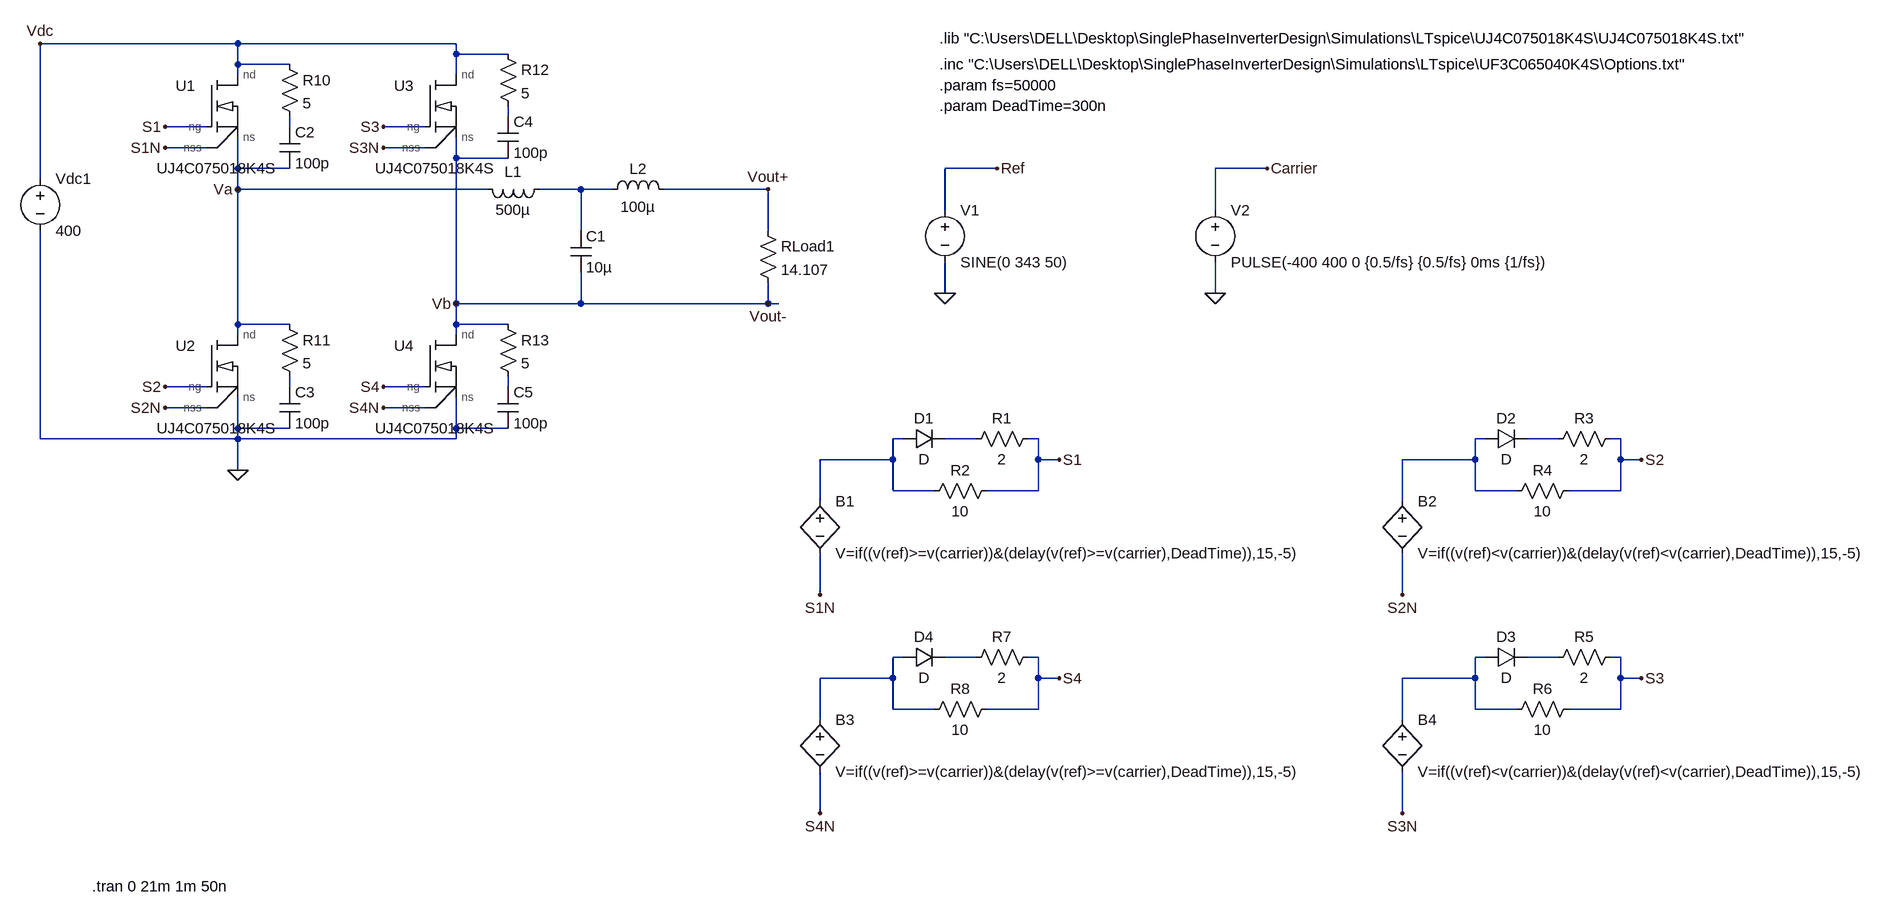
[diagram p0: schematic Bipolar_UJ4C075018K4S_DeadTime.asc]
Bipolar_UJ4C075018K4S_DeadTime.asc, the LTspice schematic file:
Version 4
SHEET 1 1412 752
WIRE -1328 -560 -1632 -560
WIRE -992 -560 -1328 -560
WIRE -992 -544 -992 -560
WIRE -912 -544 -992 -544
WIRE -1328 -528 -1328 -560
WIRE -1248 -528 -1328 -528
WIRE -1328 -512 -1328 -528
WIRE -992 -512 -992 -544
WIRE -912 -448 -912 -464
WIRE -1376 -432 -1440 -432
WIRE -1248 -432 -1248 -448
WIRE -1040 -432 -1104 -432
WIRE -1376 -400 -1440 -400
WIRE -1040 -400 -1104 -400
WIRE -992 -384 -992 -416
WIRE -912 -384 -992 -384
WIRE -1328 -368 -1328 -416
WIRE -1248 -368 -1328 -368
WIRE -160 -368 -240 -368
WIRE 256 -368 176 -368
WIRE -1632 -352 -1632 -560
WIRE -1328 -336 -1328 -368
WIRE -944 -336 -1328 -336
WIRE -800 -336 -864 -336
WIRE -752 -336 -800 -336
WIRE -512 -336 -672 -336
WIRE -240 -304 -240 -368
WIRE 176 -304 176 -368
WIRE -800 -272 -800 -336
WIRE -512 -272 -512 -336
WIRE -240 -176 -240 -224
WIRE 176 -176 176 -224
WIRE -992 -160 -992 -384
WIRE -800 -160 -800 -208
WIRE -800 -160 -992 -160
WIRE -512 -160 -512 -192
WIRE -512 -160 -800 -160
WIRE -496 -160 -512 -160
WIRE -1328 -128 -1328 -336
WIRE -1248 -128 -1328 -128
WIRE -992 -128 -992 -160
WIRE -912 -128 -992 -128
WIRE -1328 -112 -1328 -128
WIRE -992 -112 -992 -128
WIRE -1376 -32 -1440 -32
WIRE -1248 -32 -1248 -48
WIRE -1040 -32 -1104 -32
WIRE -912 -32 -912 -48
WIRE -1376 0 -1440 0
WIRE -1040 0 -1104 0
WIRE -1328 32 -1328 -16
WIRE -1248 32 -1328 32
WIRE -992 32 -992 -16
WIRE -912 32 -992 32
WIRE -1632 48 -1632 -272
WIRE -1328 48 -1328 32
WIRE -1328 48 -1632 48
WIRE -992 48 -992 32
WIRE -992 48 -1328 48
WIRE -304 48 -320 48
WIRE -192 48 -240 48
WIRE -96 48 -112 48
WIRE 592 48 576 48
WIRE 704 48 656 48
WIRE 800 48 784 48
WIRE -320 80 -320 48
WIRE -320 80 -432 80
WIRE -96 80 -96 48
WIRE -64 80 -96 80
WIRE 576 80 576 48
WIRE 576 80 464 80
WIRE 800 80 800 48
WIRE 832 80 800 80
WIRE -1328 96 -1328 48
WIRE -320 128 -320 80
WIRE -256 128 -320 128
WIRE -96 128 -96 80
WIRE -96 128 -176 128
WIRE 576 128 576 80
WIRE 640 128 576 128
WIRE 800 128 800 80
WIRE 800 128 720 128
WIRE -432 144 -432 80
WIRE 464 144 464 80
WIRE -432 288 -432 224
WIRE 464 288 464 224
WIRE -304 384 -320 384
WIRE -192 384 -240 384
WIRE -96 384 -112 384
WIRE 592 384 576 384
WIRE 704 384 656 384
WIRE 800 384 784 384
WIRE -320 416 -320 384
WIRE -320 416 -432 416
WIRE -96 416 -96 384
WIRE -64 416 -96 416
WIRE 576 416 576 384
WIRE 576 416 464 416
WIRE 800 416 800 384
WIRE 832 416 800 416
WIRE -320 464 -320 416
WIRE -256 464 -320 464
WIRE -96 464 -96 416
WIRE -96 464 -176 464
WIRE 576 464 576 416
WIRE 640 464 576 464
WIRE 800 464 800 416
WIRE 800 464 720 464
WIRE -432 480 -432 416
WIRE 464 480 464 416
WIRE -432 624 -432 560
WIRE 464 624 464 560
FLAG -240 -176 0
FLAG -160 -368 Ref
FLAG 176 -176 0
FLAG 256 -368 Carrier
FLAG -64 80 S1
FLAG 832 80 S2
FLAG -432 288 S1N
FLAG 464 288 S2N
FLAG -64 416 S4
FLAG -432 624 S4N
FLAG 832 416 S3
FLAG 464 624 S3N
FLAG -1328 96 0
FLAG -1440 -432 S1
FLAG -1440 -32 S2
FLAG -1440 -400 S1N
FLAG -1440 0 S2N
FLAG -1104 -432 S3
FLAG -1104 -400 S3N
FLAG -1104 -32 S4
FLAG -1104 0 S4N
FLAG -1632 -560 Vdc
FLAG -1328 -336 Va
FLAG -992 -160 Vb
FLAG -512 -336 Vout+
FLAG -512 -160 Vout-
SYMBOL voltage -240 -320 R0
WINDOW 123 0 0 Left 0
WINDOW 39 0 0 Left 0
SYMATTR InstName V1
SYMATTR Value SINE(0 343 50)
SYMBOL voltage 176 -320 R0
WINDOW 123 0 0 Left 0
WINDOW 39 0 0 Left 0
SYMATTR InstName V2
SYMATTR Value PULSE(-400 400 0 {0.5/fs} {0.5/fs} 0ms {1/fs})
SYMBOL bv -432 128 R0
SYMATTR InstName B1
SYMATTR Value V=if((v(ref)>=v(carrier))&(delay(v(ref)>=v(carrier),DeadTime)),15,-5)
SYMBOL bv 464 128 R0
SYMATTR InstName B2
SYMATTR Value V=if((v(ref)<v(carrier))&(delay(v(ref)<v(carrier),DeadTime)),15,-5)
SYMBOL res -96 32 R90
WINDOW 0 0 56 VBottom 2
WINDOW 3 32 56 VTop 2
SYMATTR InstName R1
SYMATTR Value 2
SYMBOL diode -304 64 R270
WINDOW 0 32 32 VTop 2
WINDOW 3 0 32 VBottom 2
SYMATTR InstName D1
SYMBOL res -160 112 R90
WINDOW 0 0 56 VBottom 2
WINDOW 3 32 56 VTop 2
SYMATTR InstName R2
SYMATTR Value 10
SYMBOL bv -432 464 R0
SYMATTR InstName B3
SYMATTR Value V=if((v(ref)>=v(carrier))&(delay(v(ref)>=v(carrier),DeadTime)),15,-5)
SYMBOL bv 464 464 R0
SYMATTR InstName B4
SYMATTR Value V=if((v(ref)<v(carrier))&(delay(v(ref)<v(carrier),DeadTime)),15,-5)
SYMBOL res 800 32 R90
WINDOW 0 0 56 VBottom 2
WINDOW 3 32 56 VTop 2
SYMATTR InstName R3
SYMATTR Value 2
SYMBOL diode 592 64 R270
WINDOW 0 32 32 VTop 2
WINDOW 3 0 32 VBottom 2
SYMATTR InstName D2
SYMBOL res 736 112 R90
WINDOW 0 0 56 VBottom 2
WINDOW 3 32 56 VTop 2
SYMATTR InstName R4
SYMATTR Value 10
SYMBOL res 800 368 R90
WINDOW 0 0 56 VBottom 2
WINDOW 3 32 56 VTop 2
SYMATTR InstName R5
SYMATTR Value 2
SYMBOL diode 592 400 R270
WINDOW 0 32 32 VTop 2
WINDOW 3 0 32 VBottom 2
SYMATTR InstName D3
SYMBOL res 736 448 R90
WINDOW 0 0 56 VBottom 2
WINDOW 3 32 56 VTop 2
SYMATTR InstName R6
SYMATTR Value 10
SYMBOL res -96 368 R90
WINDOW 0 0 56 VBottom 2
WINDOW 3 32 56 VTop 2
SYMATTR InstName R7
SYMATTR Value 2
SYMBOL diode -304 400 R270
WINDOW 0 32 32 VTop 2
WINDOW 3 0 32 VBottom 2
SYMATTR InstName D4
SYMBOL res -160 448 R90
WINDOW 0 0 56 VBottom 2
WINDOW 3 32 56 VTop 2
SYMATTR InstName R8
SYMATTR Value 10
SYMBOL voltage -1632 -368 R0
WINDOW 123 0 0 Left 0
WINDOW 39 0 0 Left 0
SYMATTR InstName Vdc1
SYMATTR Value 400
SYMBOL UF3C065040K4S -1360 -464 R0
SYMATTR InstName U1
SYMATTR Value UJ4C075018K4S
SYMBOL UF3C065040K4S -1360 -64 R0
SYMATTR InstName U2
SYMATTR Value UJ4C075018K4S
SYMBOL UF3C065040K4S -1024 -464 R0
SYMATTR InstName U3
SYMATTR Value UJ4C075018K4S
SYMBOL UF3C065040K4S -1024 -64 R0
SYMATTR InstName U4
SYMATTR Value UJ4C075018K4S
SYMBOL ind -848 -352 R90
WINDOW 0 5 56 VBottom 2
WINDOW 3 32 56 VTop 2
SYMATTR InstName L1
SYMATTR Value 500µ
SYMATTR SpiceLine Rser=30m
SYMBOL res -528 -288 R0
SYMATTR InstName RLoad1
SYMATTR Value 14.107
SYMBOL cap -816 -272 R0
SYMATTR InstName C1
SYMATTR Value 10µ
SYMATTR SpiceLine Rser=0.1m
SYMBOL ind -768 -320 R270
WINDOW 0 32 56 VTop 2
WINDOW 3 5 56 VBottom 2
SYMATTR InstName L2
SYMATTR Value 100µ
SYMBOL res -1264 -544 R0
SYMATTR InstName R10
SYMATTR Value 5
SYMBOL cap -1264 -432 R0
SYMATTR InstName C2
SYMATTR Value 100p
SYMBOL res -1264 -144 R0
SYMATTR InstName R11
SYMATTR Value 5
SYMBOL cap -1264 -32 R0
SYMATTR InstName C3
SYMATTR Value 100p
SYMBOL res -928 -560 R0
SYMATTR InstName R12
SYMATTR Value 5
SYMBOL cap -928 -448 R0
SYMATTR InstName C4
SYMATTR Value 100p
SYMBOL res -928 -144 R0
SYMATTR InstName R13
SYMATTR Value 5
SYMBOL cap -928 -32 R0
SYMATTR InstName C5
SYMATTR Value 100p
TEXT -248 -496 Left 2 !.param fs=50000\n.param DeadTime=300n
TEXT -1552 736 Left 2 !.tran 0 21m 1m 50n
TEXT -248 -528 Left 2 !.inc "C:\\Users\\DELL\\Desktop\\SinglePhaseInverterDesign\\Simulations\\LTspice\\UF3C065040K4S\\Options.txt"
TEXT -248 -568 Left 2 !.lib "C:\\Users\\DELL\\Desktop\\SinglePhaseInverterDesign\\Simulations\\LTspice\\UJ4C075018K4S\\UJ4C075018K4S.txt"

The netlist it stands for:
* Bipolar_UJ4C075018K4S_DeadTime.asc
V1 Ref 0 SINE(0 343 50)
V2 Carrier 0 PULSE(-400 400 0 {0.5/fs} {0.5/fs} 0ms {1/fs})
B1 N006 S1N V=if((v(ref)>=v(carrier))&(delay(v(ref)>=v(carrier),DeadTime)),15,-5)
B2 N008 S2N V=if((v(ref)<v(carrier))&(delay(v(ref)<v(carrier),DeadTime)),15,-5)
R1 S1 N007 2
D1 N006 N007 D
R2 S1 N006 10
B3 N010 S4N V=if((v(ref)>=v(carrier))&(delay(v(ref)>=v(carrier),DeadTime)),15,-5)
B4 N012 S3N V=if((v(ref)<v(carrier))&(delay(v(ref)<v(carrier),DeadTime)),15,-5)
R3 S2 N009 2
D2 N008 N009 D
R4 S2 N008 10
R5 S3 N013 2
D3 N012 N013 D
R6 S3 N012 10
R7 S4 N011 2
D4 N010 N011 D
R8 S4 N010 10
Vdc1 Vdc 0 400
XU1 Vdc S1 Va S1N UJ4C075018K4S  ; pins nd ng ns nss
XU2 Va S2 0 S2N UJ4C075018K4S  ; pins nd ng ns nss
XU3 Vdc S3 Vout- S3N UJ4C075018K4S  ; pins nd ng ns nss
XU4 Vout- S4 0 S4N UJ4C075018K4S  ; pins nd ng ns nss
L1 N003 Va 500µ Rser=30m
RLoad1 Vout+ Vout- 14.107
C1 N003 Vout- 10µ Rser=0.1m
L2 N003 Vout+ 100µ
R10 Vdc N002 5
C2 N002 Va 100p
R11 Va N004 5
C3 N004 0 100p
R12 Vdc N001 5
C4 N001 Vout- 100p
R13 Vout- N005 5
C5 N005 0 100p
.model D D
.lib standard.dio
.param fs=50000
.param DeadTime=300n
.tran 0 21m 1m 50n
.inc "C:\Users\DELL\Desktop\SinglePhaseInverterDesign\Simulations\LTspice\UF3C065040K4S\Options.txt"
.lib "C:\Users\DELL\Desktop\SinglePhaseInverterDesign\Simulations\LTspice\UJ4C075018K4S\UJ4C075018K4S.txt"
.lib C:\Users\ycay\Desktop\FullBridge_Modulations\Transformless_SP_Inverter\FullBridge_LTspice\UF3C065040K4S\UF3C065040K4S.txt
.backanno
.end